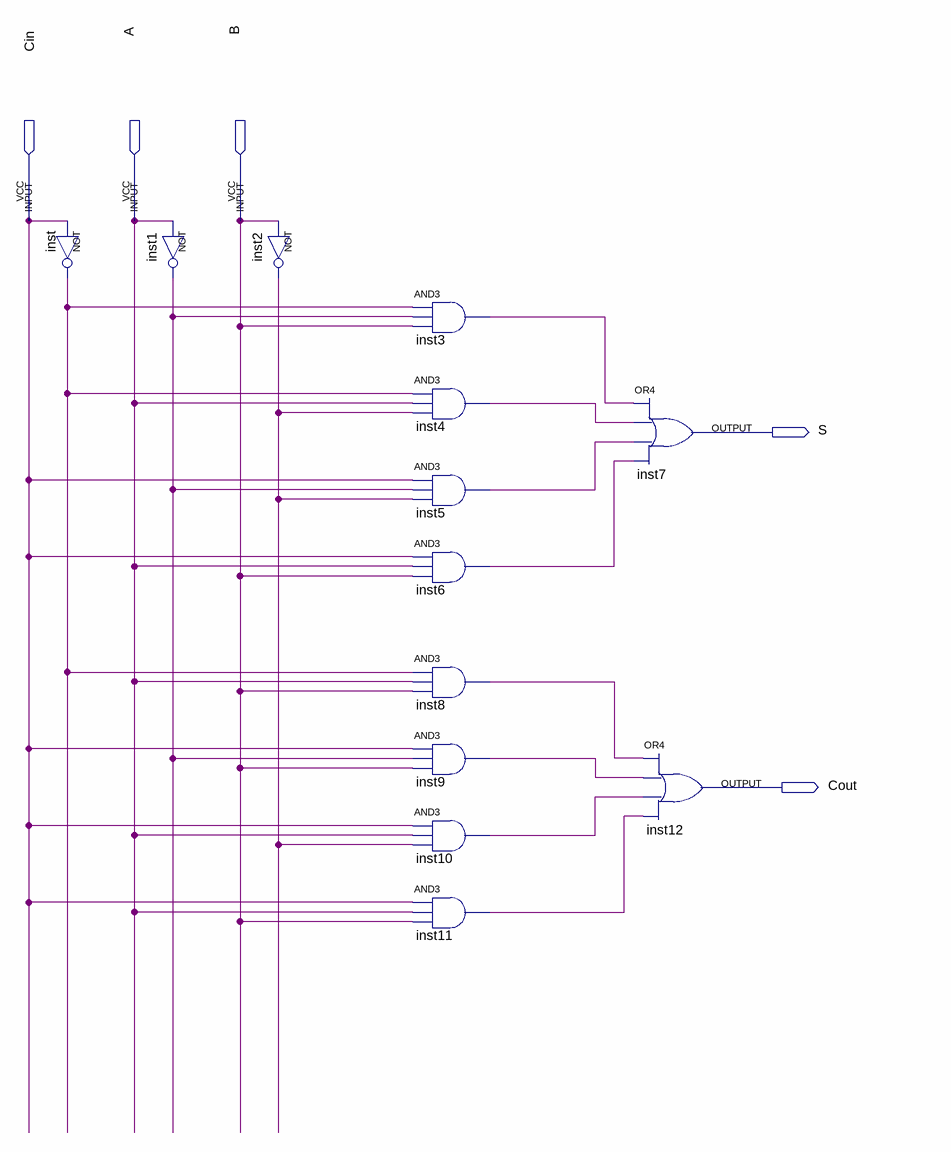
[diagram p0: schematic sheet]
// Quartus schematic SUM1Bit.bdf as structural Verilog: 13 symbols, 5 pins
module SUM1Bit (
  input  Cin,
  input  A,
  input  B,
  output S,
  output Cout
);

  wire inst1_out, inst2_out, inst3_out, inst4_out, inst5_out, inst6_out, inst8_out, inst9_out, inst10_out,
       inst11_out, inst_out;

  not inst (inst_out, Cin);
  not inst1 (inst1_out, A);
  not inst2 (inst2_out, B);
  and inst3 (inst3_out, inst_out, inst1_out, B);
  and inst4 (inst4_out, inst_out, A, inst2_out);
  and inst5 (inst5_out, Cin, inst1_out, inst2_out);
  and inst6 (inst6_out, Cin, A, B);
  and inst8 (inst8_out, inst_out, A, B);
  and inst9 (inst9_out, Cin, inst1_out, B);
  and inst10 (inst10_out, Cin, A, inst2_out);
  and inst11 (inst11_out, Cin, A, B);
  or inst7 (S, inst3_out, inst4_out, inst5_out, inst6_out);
  or inst12 (Cout, inst8_out, inst9_out, inst10_out, inst11_out);
endmodule
